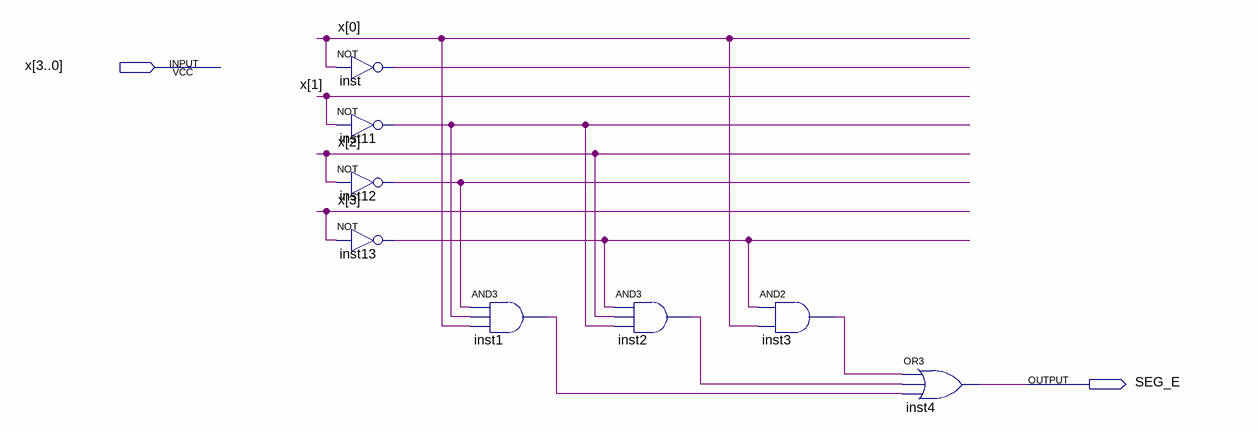
[diagram p0: schematic sheet]
// Quartus schematic SEG_E.bdf as structural Verilog: 8 symbols, 2 pins
module SEG_E (
  input  [3:0] x,
  output SEG_E
);

  wire inst1_out, inst2_out, inst3_out, inst11_out, inst12_out, inst13_out, inst_out;

  not inst (inst_out, x[0]);
  not inst11 (inst11_out, x[1]);
  not inst12 (inst12_out, x[2]);
  not inst13 (inst13_out, x[3]);
  and inst1 (inst1_out, inst12_out, inst11_out, x[0]);
  and inst2 (inst2_out, inst13_out, x[2], inst11_out);
  and inst3 (inst3_out, inst13_out, x[0]);
  or inst4 (SEG_E, inst3_out, inst2_out, inst1_out);
endmodule
